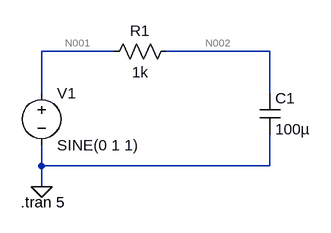
[diagram p0: schematic Draft7.asc]
Draft7.asc, the LTspice schematic file:
Version 4
SHEET 1 880 680
WIRE 96 80 -16 80
WIRE 336 80 176 80
WIRE -16 144 -16 80
WIRE 336 144 336 80
WIRE -16 256 -16 224
WIRE 336 256 336 208
WIRE 336 256 -16 256
WIRE -16 288 -16 256
FLAG -16 288 0
SYMBOL res 192 64 R90
WINDOW 0 0 56 VBottom 2
WINDOW 3 32 56 VTop 2
SYMATTR InstName R1
SYMATTR Value 1k
SYMBOL cap 320 144 R0
SYMATTR InstName C1
SYMATTR Value 100µ
SYMBOL voltage -16 128 R0
WINDOW 123 0 0 Left 0
WINDOW 39 0 0 Left 0
SYMATTR InstName V1
SYMATTR Value SINE(0 1 1)
TEXT -48 312 Left 2 !.tran 5

The netlist it stands for:
* Draft7.asc
R1 N002 N001 1k
C1 N002 0 100µ
V1 N001 0 SINE(0 1 1)
.tran 5
.backanno
.end

* Results of the author's LTspice run, read from the files saved beside the schematic
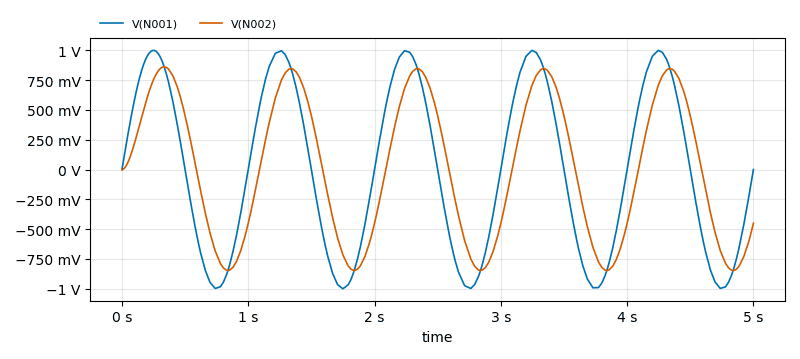
[diagram p1: Transient Analysis of Draft7.asc, plotted from the saved traces]
* Transient Analysis, 1 run:
*   V(N001): min -1 V, max 999.8 mV, average 128.7 µV, rms 706.1 mV, last 0 V
*   V(N002): min -846.5 mV, max 862 mV, average 9.083 mV, rms 600.1 mV, last -450.5 mV